# Altium project LimeSDR-Mini_2v1.PrjPcb (part 3 of 5)

## Sheet 08_FPGA.SchDoc: FPGA
size A3; Organization: Lime Microsystems; Address1: Surrey Tech Centre; Address2: Guildford GU2 7YG; Address3: Surrey; Address4: United Kingdom; Revision: v2.1; SheetNumber: 8; SheetTotal: 10
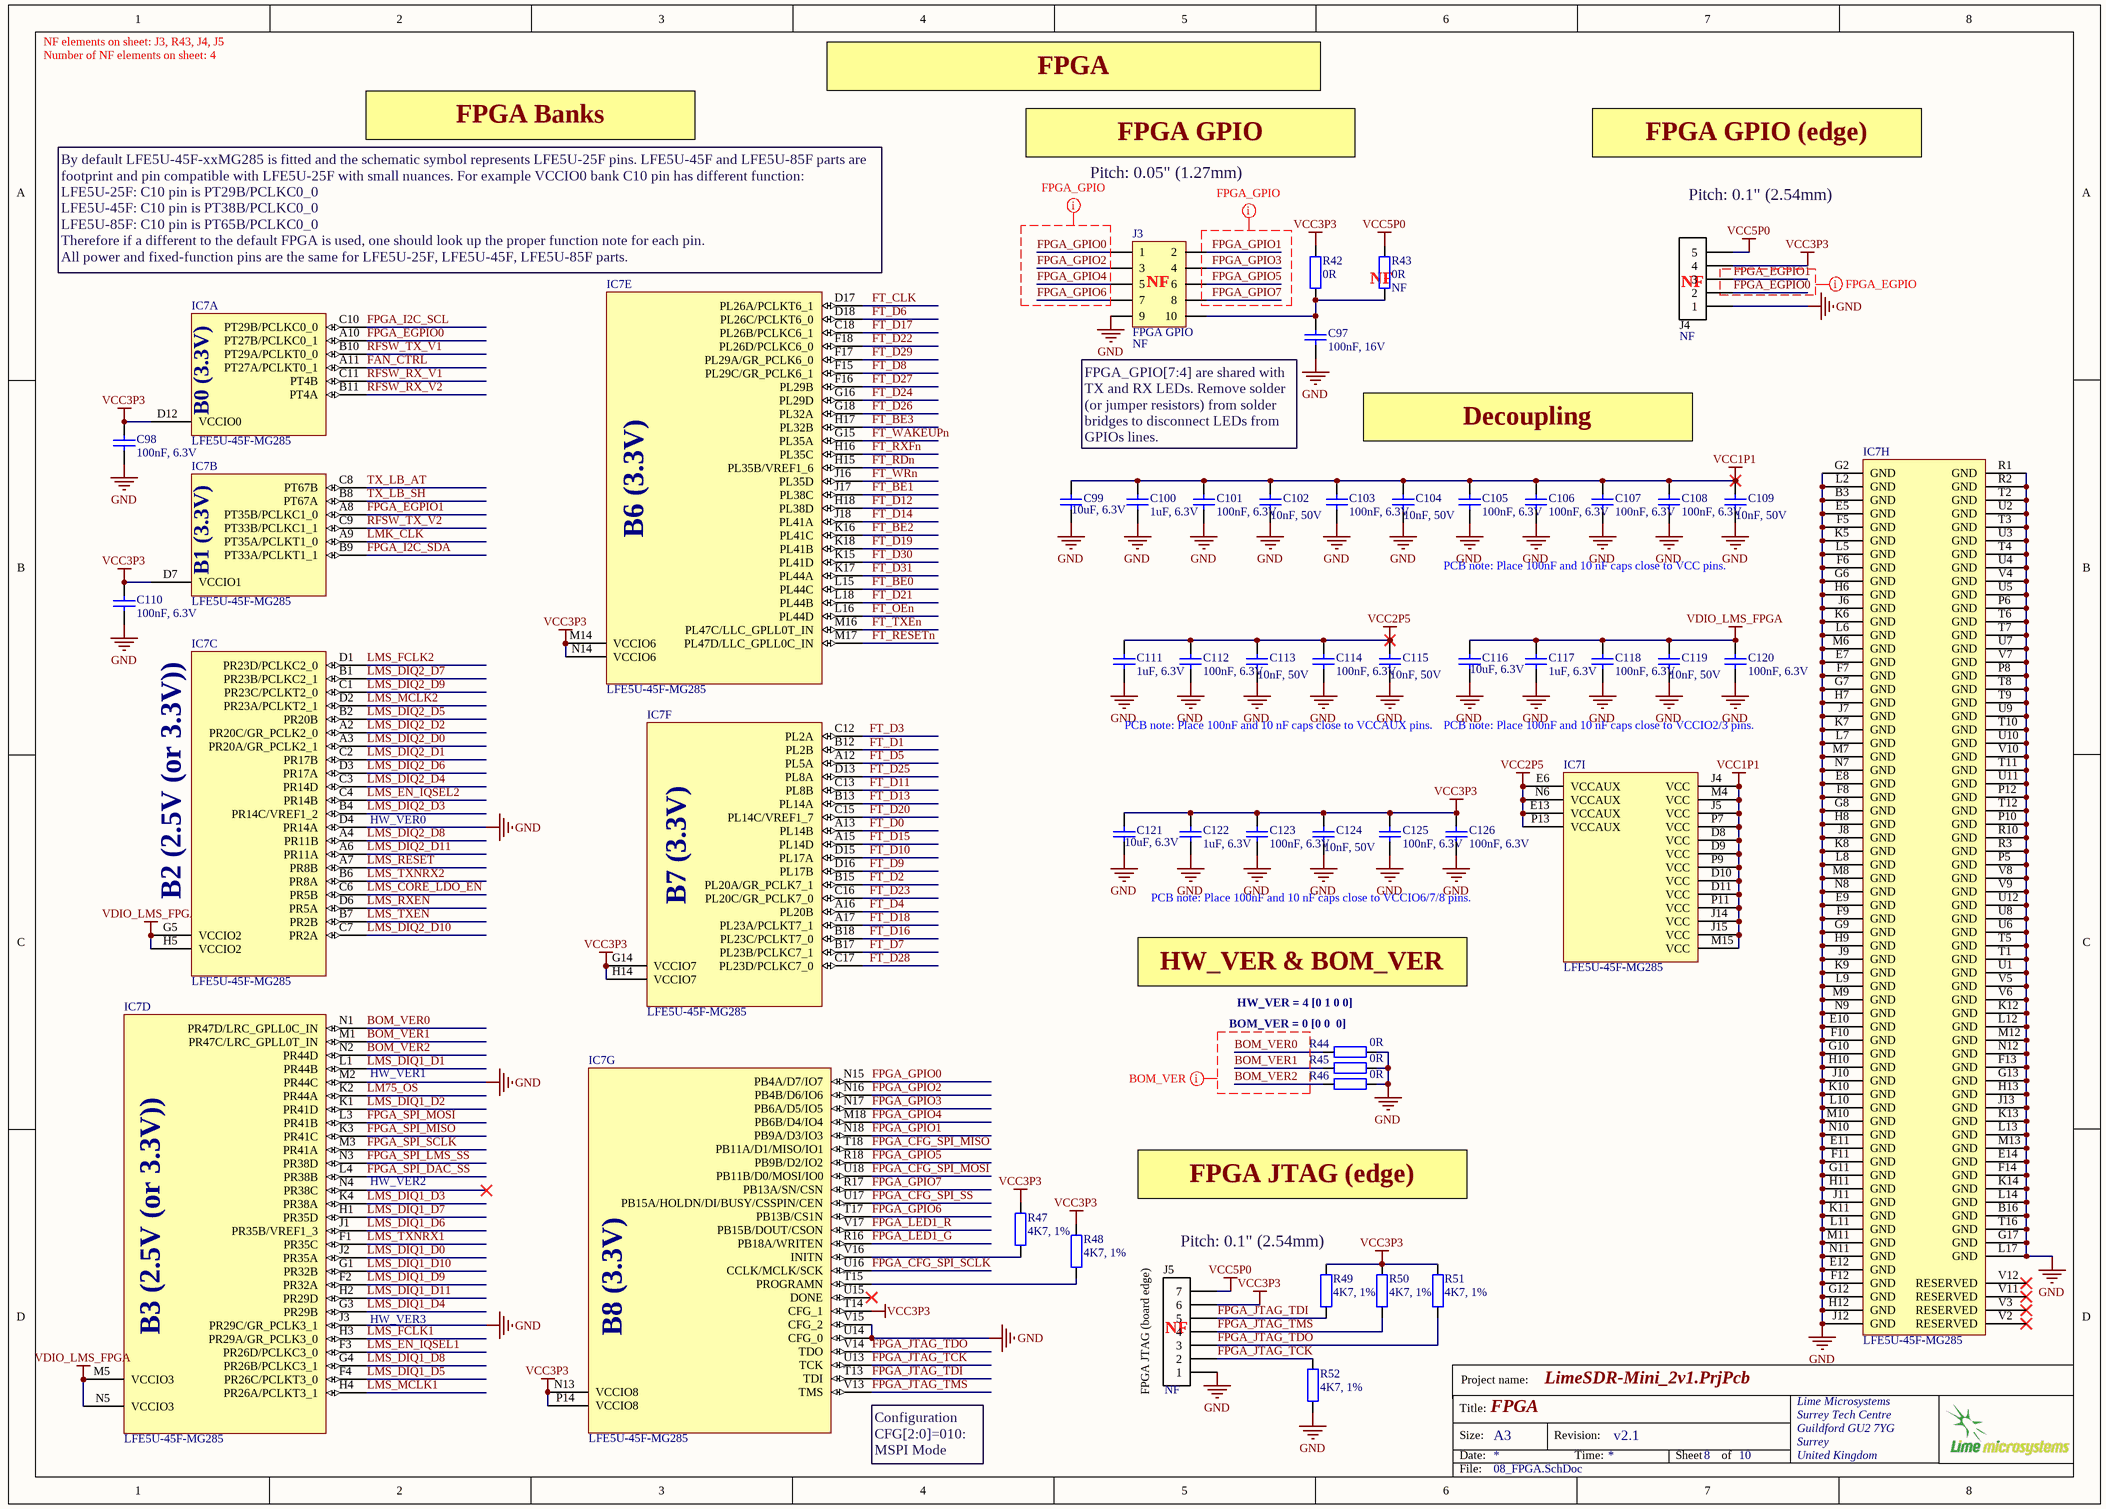
[diagram p7: 08_FPGA.SchDoc]

### Parts
C97  100nF, 16V  [CAP0402]
C98  100nF, 6.3V  [CAP0201]
C99  10uF, 6.3V  [CAP0603]
C100  1uF, 6.3V  [CAP0201]
C101  100nF, 6.3V  [CAP0201]
C102  10nF, 50V  [CAP0402]
C103  100nF, 6.3V  [CAP0201]
C104  10nF, 50V  [CAP0402]
C105  100nF, 6.3V  [CAP0201]
C106  100nF, 6.3V  [CAP0201]
C107  100nF, 6.3V  [CAP0201]
C108  100nF, 6.3V  [CAP0201]
C109  10nF, 50V  [CAP0402]
C110  100nF, 6.3V  [CAP0201]
C111  1uF, 6.3V  [CAP0201]
C112  100nF, 6.3V  [CAP0201]
C113  10nF, 50V  [CAP0402]
C114  100nF, 6.3V  [CAP0201]
C115  10nF, 50V  [CAP0402]
C116  10uF, 6.3V  [CAP0603]
C117  1uF, 6.3V  [CAP0201]
C118  100nF, 6.3V  [CAP0201]
C119  10nF, 50V  [CAP0402]
C120  100nF, 6.3V  [CAP0201]
C121  10uF, 6.3V  [CAP0603]
C122  1uF, 6.3V  [CAP0201]
C123  100nF, 6.3V  [CAP0201]
C124  10nF, 50V  [CAP0402]
C125  100nF, 6.3V  [CAP0201]
C126  100nF, 6.3V  [CAP0201]
IC7  LFE5U-45F-MG285  [LFE5U-25F-8MG285C_LATTICE_FPGA]  (parts A,B,C,D,E,F,G,H,I of 9)
J3  FPGA GPIO  Assembly Info: NF  [SWD_10_pin]
J4  Assembly Info: NF  [Header5x1_TH_v2]  (hidden comment: FPGA EGPIO (board edge))
J5  FPGA JTAG (board edge)  Assembly Info: NF  [Header7x1_TH_v2]
R42  0R  [RES0402]
R43  0R  Assembly Info: NF  [RES0402]
R44  0R  [RES0402]
R45  0R  [RES0402]
R46  0R  [RES0402]
R47  4K7, 1%  [RES0402]
R48  4K7, 1%  [RES0402]
R49  4K7, 1%  [RES0402]
R50  4K7, 1%  [RES0402]
R51  4K7, 1%  [RES0402]
R52  4K7, 1%  [RES0402]

### Nets
GND: C97.1 C98.2 C99.1 C100.1 C101.2 C102.1 C103.2 C104.1 C105.2 C106.2 C107.2 C108.2 C109.1 C110.2 C111.1 C112.2 C113.1 C114.2 C115.1 C116.1 C117.1 C118.2 C119.1 C120.2 C121.1 C122.2 C123.2 C124.1 C125.2 C126.2 IC7.B3(GND) IC7.B16(GND) IC7.D4(PR14A) IC7.E5(GND) IC7.E7(GND) IC7.E8(GND) IC7.E9(GND) IC7.E10(GND) IC7.E11(GND) IC7.E12(GND) IC7.E14(GND) IC7.F5(GND) IC7.F6(GND) IC7.F7(GND) IC7.F8(GND) IC7.F9(GND) IC7.F10(GND) IC7.F11(GND) IC7.F12(GND) IC7.F13(GND) IC7.F14(GND) IC7.G2(GND) IC7.G6(GND) IC7.G7(GND) IC7.G8(GND) IC7.G9(GND) IC7.G10(GND) IC7.G11(GND) IC7.G12(GND) IC7.G13(GND) IC7.G17(GND) IC7.H6(GND) IC7.H7(GND) IC7.H8(GND) IC7.H9(GND) IC7.H10(GND) IC7.H11(GND) IC7.H12(GND) IC7.H13(GND) IC7.J3(PR29C/GR_PCLK3_1) IC7.J6(GND) IC7.J7(GND) IC7.J8(GND) IC7.J9(GND) IC7.J10(GND) IC7.J11(GND) IC7.J12(GND) IC7.J13(GND) IC7.K5(GND) IC7.K6(GND) IC7.K7(GND) IC7.K8(GND) IC7.K9(GND) IC7.K10(GND) IC7.K11(GND) IC7.K12(GND) IC7.K13(GND) IC7.K14(GND) IC7.L2(GND) IC7.L5(GND) IC7.L6(GND) IC7.L7(GND) IC7.L8(GND) IC7.L9(GND) IC7.L10(GND) IC7.L11(GND) IC7.L12(GND) IC7.L13(GND) IC7.L14(GND) IC7.L17(GND) IC7.M2(PR44C) IC7.M6(GND) IC7.M7(GND) IC7.M8(GND) IC7.M9(GND) IC7.M10(GND) IC7.M11(GND) IC7.M12(GND) IC7.M13(GND) IC7.N7(GND) IC7.N8(GND) IC7.N9(GND) IC7.N10(GND) IC7.N11(GND) IC7.N12(GND) IC7.P5(GND) IC7.P6(GND) IC7.P8(GND) IC7.P10(GND) IC7.P12(GND) IC7.R1(GND) IC7.R2(GND) IC7.R3(GND) IC7.R10(GND) IC7.T1(GND) IC7.T2(GND) IC7.T3(GND) IC7.T4(GND) IC7.T5(GND) IC7.T6(GND) IC7.T7(GND) IC7.T8(GND) IC7.T9(GND) IC7.T10(GND) IC7.T11(GND) IC7.T12(GND) IC7.T16(GND) IC7.U1(GND) IC7.U2(GND) IC7.U3(GND) IC7.U4(GND) IC7.U5(GND) IC7.U6(GND) IC7.U7(GND) IC7.U8(GND) IC7.U9(GND) IC7.U10(GND) IC7.U11(GND) IC7.U12(GND) IC7.U14(CFG_0) IC7.V4(GND) IC7.V5(GND) IC7.V6(GND) IC7.V7(GND) IC7.V8(GND) IC7.V9(GND) IC7.V10(GND) IC7.V15(CFG_2) J3.9 J4.1 J5.1 R44.1 R45.1 R46.1 R52.2
VCC1P1: C99.2 C100.2 C101.1 C102.2 C103.1 C104.2 C105.1 C106.1 C107.1 C108.1 C109.2 IC7.D8(VCC) IC7.D9(VCC) IC7.D10(VCC) IC7.D11(VCC) IC7.J4(VCC) IC7.J5(VCC) IC7.J14(VCC) IC7.J15(VCC) IC7.M4(VCC) IC7.M15(VCC) IC7.P7(VCC) IC7.P9(VCC) IC7.P11(VCC)
VCC2P5: C111.2 C112.1 C113.2 C114.1 C115.2 IC7.E6(VCCAUX) IC7.E13(VCCAUX) IC7.N6(VCCAUX) IC7.P13(VCCAUX)
VCC3P3: C98.1 C110.1 C121.2 C122.1 C123.1 C124.2 C125.1 C126.1 IC7.D7(VCCIO1) IC7.D12(VCCIO0) IC7.G14(VCCIO7) IC7.H14(VCCIO7) IC7.M14(VCCIO6) IC7.N13(VCCIO8) IC7.N14(VCCIO6) IC7.P14(VCCIO8) IC7.T14(CFG_1) J4.4 J5.6 R42.1 R47.1 R48.1 R49.1 R50.1 R51.1
VCC5P0: J4.5 J5.7 R43.1
VDIO_LMS_FPGA: C116.2 C117.2 C118.1 C119.2 C120.1 IC7.G5(VCCIO2) IC7.H5(VCCIO2) IC7.M5(VCCIO3) IC7.N5(VCCIO3)
BOM_VER0: IC7.N1(PR47D/LRC_GPLL0C_IN) R44.2
BOM_VER1: IC7.M1(PR47C/LRC_GPLL0T_IN) R45.2
BOM_VER2: IC7.N2(PR44D) R46.2
FAN_CTRL: IC7.A11(PT27A/PCLKT0_1)
FPGA_CFG_SPI_MISO: IC7.T18(PB11A/D1/MISO/IO1)
FPGA_CFG_SPI_MOSI: IC7.U18(PB11B/D0/MOSI/IO0)
FPGA_CFG_SPI_SCLK: IC7.U16(CCLK/MCLK/SCK)
FPGA_CFG_SPI_SS: IC7.U17(PB15A/HOLDN/DI/BUSY/CSSPIN/CEN)
FPGA_EGPIO0: IC7.A10(PT27B/PCLKC0_1) J4.2
FPGA_EGPIO1: IC7.A8(PT35B/PCLKC1_0) J4.3
FPGA_GPIO0: IC7.N15(PB4A/D7/IO7) J3.1
FPGA_GPIO1: IC7.N18(PB9A/D3/IO3) J3.2
FPGA_GPIO2: IC7.N16(PB4B/D6/IO6) J3.3
FPGA_GPIO3: IC7.N17(PB6A/D5/IO5) J3.4
FPGA_GPIO4: IC7.M18(PB6B/D4/IO4) J3.5
FPGA_GPIO5: IC7.R18(PB9B/D2/IO2) J3.6
FPGA_GPIO6: IC7.T17(PB13B/CS1N) J3.7
FPGA_GPIO7: IC7.R17(PB13A/SN/CSN) J3.8
FPGA_I2C_SCL: IC7.C10(PT29B/PCLKC0_0)
FPGA_I2C_SDA: IC7.B9(PT33A/PCLKT1_1)
FPGA_JTAG_TCK: IC7.U13(TCK) J5.2 R52.1
FPGA_JTAG_TDI: IC7.T13(TDI) J5.5 R49.2
FPGA_JTAG_TDO: IC7.V14(TDO) J5.3 R51.2
FPGA_JTAG_TMS: IC7.V13(TMS) J5.4 R50.2
FPGA_LED1_G: IC7.R16(PB18A/WRITEN)
FPGA_LED1_R: IC7.V17(PB15B/DOUT/CSON)
FPGA_SPI_DAC_SS: IC7.L4(PR38B)
FPGA_SPI_LMS_SS: IC7.N3(PR38D)
FPGA_SPI_MISO: IC7.K3(PR41C)
FPGA_SPI_MOSI: IC7.L3(PR41B)
FPGA_SPI_SCLK: IC7.M3(PR41A)
FT_BE0: IC7.L15(PL44C)
FT_BE1: IC7.J17(PL38C)
FT_BE2: IC7.K16(PL41C)
FT_BE3: IC7.H17(PL32B)
FT_CLK: IC7.D17(PL26A/PCLKT6_1)
FT_D0: IC7.A13(PL14B)
FT_D1: IC7.B12(PL2B)
FT_D2: IC7.B15(PL20A/GR_PCLK7_1)
FT_D3: IC7.C12(PL2A)
FT_D4: IC7.A16(PL20B)
FT_D5: IC7.A12(PL5A)
FT_D6: IC7.D18(PL26C/PCLKT6_0)
FT_D7: IC7.B17(PL23B/PCLKC7_1)
FT_D8: IC7.F15(PL29C/GR_PCLK6_1)
FT_D9: IC7.D16(PL17B)
FT_D10: IC7.D15(PL17A)
FT_D11: IC7.C13(PL8B)
FT_D12: IC7.H18(PL38D)
FT_D13: IC7.B13(PL14A)
FT_D14: IC7.J18(PL41A)
FT_D15: IC7.A15(PL14D)
FT_D16: IC7.B18(PL23C/PCLKT7_0)
FT_D17: IC7.C18(PL26B/PCLKC6_1)
FT_D18: IC7.A17(PL23A/PCLKT7_1)
FT_D19: IC7.K18(PL41B)
FT_D20: IC7.C15(PL14C/VREF1_7)
FT_D21: IC7.L18(PL44B)
FT_D22: IC7.F18(PL26D/PCLKC6_0)
FT_D23: IC7.C16(PL20C/GR_PCLK7_0)
FT_D24: IC7.G16(PL29D)
FT_D25: IC7.D13(PL8A)
FT_D26: IC7.G18(PL32A)
FT_D27: IC7.F16(PL29B)
FT_D28: IC7.C17(PL23D/PCLKC7_0)
FT_D29: IC7.F17(PL29A/GR_PCLK6_0)
FT_D30: IC7.K15(PL41D)
FT_D31: IC7.K17(PL44A)
FT_OEn: IC7.L16(PL44D)
FT_RDn: IC7.H15(PL35B/VREF1_6)
FT_RESETn: IC7.M17(PL47D/LLC_GPLL0C_IN)
FT_RXFn: IC7.H16(PL35C)
FT_TXEn: IC7.M16(PL47C/LLC_GPLL0T_IN)
FT_WAKEUPn: IC7.G15(PL35A)
FT_WRn: IC7.J16(PL35D)
LM75_OS: IC7.K2(PR44A)
LMK_CLK: IC7.A9(PT35A/PCLKT1_0)
LMS_CORE_LDO_EN: IC7.C6(PR5B)
LMS_DIQ1_D0: IC7.J2(PR35A)
LMS_DIQ1_D1: IC7.L1(PR44B)
LMS_DIQ1_D2: IC7.K1(PR41D)
LMS_DIQ1_D3: IC7.K4(PR38A)
LMS_DIQ1_D4: IC7.G3(PR29B)
LMS_DIQ1_D5: IC7.F4(PR26C/PCLKT3_0)
LMS_DIQ1_D6: IC7.J1(PR35B/VREF1_3)
LMS_DIQ1_D7: IC7.H1(PR35D)
LMS_DIQ1_D8: IC7.G4(PR26B/PCLKC3_1)
LMS_DIQ1_D9: IC7.F2(PR32A)
LMS_DIQ1_D10: IC7.G1(PR32B)
LMS_DIQ1_D11: IC7.H2(PR29D)
LMS_DIQ2_D0: IC7.A3(PR20A/GR_PCLK2_1)
LMS_DIQ2_D1: IC7.C2(PR17B)
LMS_DIQ2_D2: IC7.A2(PR20C/GR_PCLK2_0)
LMS_DIQ2_D3: IC7.B4(PR14C/VREF1_2)
LMS_DIQ2_D4: IC7.C3(PR14D)
LMS_DIQ2_D5: IC7.B2(PR20B)
LMS_DIQ2_D6: IC7.D3(PR17A)
LMS_DIQ2_D7: IC7.B1(PR23B/PCLKC2_1)
LMS_DIQ2_D8: IC7.A4(PR11B)
LMS_DIQ2_D9: IC7.C1(PR23C/PCLKT2_0)
LMS_DIQ2_D10: IC7.C7(PR2A)
LMS_DIQ2_D11: IC7.A6(PR11A)
LMS_EN_IQSEL1: IC7.F3(PR26D/PCLKC3_0)
LMS_EN_IQSEL2: IC7.C4(PR14B)
LMS_FCLK1: IC7.H3(PR29A/GR_PCLK3_0)
LMS_FCLK2: IC7.D1(PR23D/PCLKC2_0)
LMS_MCLK1: IC7.H4(PR26A/PCLKT3_1)
LMS_MCLK2: IC7.D2(PR23A/PCLKT2_1)
LMS_RESET: IC7.A7(PR8B)
LMS_RXEN: IC7.D6(PR5A)
LMS_TXEN: IC7.B7(PR2B)
LMS_TXNRX1: IC7.F1(PR35C)
LMS_TXNRX2: IC7.B6(PR8A)
RFSW_RX_V1: IC7.C11(PT4B)
RFSW_RX_V2: IC7.B11(PT4A)
RFSW_TX_V1: IC7.B10(PT29A/PCLKT0_0)
RFSW_TX_V2: IC7.C9(PT33B/PCLKC1_1)
TX_LB_AT: IC7.C8(PT67B)
TX_LB_SH: IC7.B8(PT67A)
NetC97_2: C97.2 J3.10 R42.2 R43.2
NetIC7_T15: IC7.T15(PROGRAMN) R48.2
NetIC7_V16: IC7.V16(INITN) R47.2

Not connected (* = marked no-connect by the designer): IC7 N4(PR38C)* U15(DONE)* V2(RESERVED)* V3(RESERVED)* V11(RESERVED)* V12(RESERVED)*

### Layout directives
net class BOM_VER: BOM_VER0, BOM_VER1, BOM_VER2
net class FPGA_GPIO: FPGA_GPIO0, FPGA_GPIO1, FPGA_GPIO2, FPGA_GPIO3, FPGA_GPIO4, FPGA_GPIO5, FPGA_GPIO6, FPGA_GPIO7
net class FPGA_EGPIO: FPGA_EGPIO0, FPGA_EGPIO1

### Notes on the sheet
- NF elements on sheet: J3, R43, J4, J5
- Number of NF elements on sheet: 4
- FPGA
- FPGA Banks
- FPGA GPIO
- Pitch: 0.05" (1.27mm)
- FPGA GPIO (edge)
- (near J4) Pitch: 0.1" (2.54mm)
- (near IC7) By default LFE5U-45F-xxMG285 is fitted and the schematic symbol represents LFE5U-25F pins. LFE5U-45F and LFE5U-85F parts are footprint and pin compatible with LFE5U-25F with small nuances. For example VCCIO0 bank C10 pin has different function:
  LFE5U-25F: C10 pin is PT29B/PCLKC0_0
  LFE5U-45F: C10 pin is PT38B/PCLKC0_0
  LFE5U-85F: C10 pin is PT65B/PCLKC0_0
  Therefore if a different to the default FPGA is used, one should look up the proper function note for each pin.
  All power and fixed-function pins are the same for LFE5U-25F, LFE5U-45F, LFE5U-85F parts.
- (near J3) NF
- (near R43) NF
- (near J4) NF
- (near IC7) B0 (3.3V)
- (near C97) FPGA_GPIO[7:4] are shared with TX and RX LEDs. Remove solder (or jumper resistors) from solder bridges to disconnect LEDs from GPIOs lines.
- Decoupling
- (near IC7) B1 (3.3V)
- (near IC7) B6 (3.3V)
- PCB note: Place 100nF and 10 nF caps close to VCC pins.
- PCB note: Place 100nF and 10 nF caps close to VCCAUX pins.
- PCB note: Place 100nF and 10 nF caps close to VCCIO2/3 pins.
- (near IC7) HW_VER0
- (near IC7) B2 (2.5V (or 3.3V))
- (near IC7) B7 (3.3V)
- PCB note: Place 100nF and 10 nF caps close to VCCIO6/7/8 pins.
- HW_VER & BOM_VER
- (near R44) BOM_VER = 0 [0 0  0]
- HW_VER = 4 [0 1 0 0]
- (near IC7) HW_VER1
- (near IC7) HW_VER2
- FPGA JTAG (edge)
- (near R49) Pitch: 0.1" (2.54mm)
- (near IC7) HW_VER3
- (near J5) NF
- (near IC7) B3 (2.5V (or 3.3V))
- (near IC7) B8 (3.3V)
- (near IC7) Configuration
  CFG[2:0]=010:
  MSPI Mode
- Project name:
- Title:
- Size:
- Date:
- A3
- Revision:
- Time:
- Sheet
- of
- File:

### Library data of the parts
C97 = Cap_0402: Manufacturer: Murata Electronics; Manufacturer Part Number: GRM155R71C104KA88D; Part Description: 0.10µF ±10% 16V X7R Ceramic Capacitor -55°C ~ 125°C Surface Mount, MLCC 0402 (1005 Metric) 0.039" L x 0.020" W (1.00mm x 0.50mm); Tolerance: 10 %; Type: General Purpose MLCC; Capacitance: 0.1 uF; Case Length: 1 mm; Dielectric: X7R; Case Height: 0.5 mm; Temperature Coefficient / Code: +/- 15 %; Value: 100nF, 16V; Supplier 1: Mouser; Supplier Part Number 1: 81-GRM155R71C104KA88; Case Code - in: 0402; RoHS: RoHS Compliant; Operating Temperature Range: - 55 C to + 125 C; Series: GRM; Termination Style: SMD/SMT; Package / Case: 0402 (1005 metric); Voltage Rating DC: 16 V; Maximum Operating Temperature: + 125 C; Case Code - mm: 1005; Minimum Operating Temperature: - 55 C; Product Category: Low & Medium Capacitance SMD Ceramic Chip Capacitors; Packaging: Reel; Product: General Type MLCCs; Category: Multilayer Ceramic Capacitors MLCC - SMD/SMT; Brand: Murata Electronics; Case Width: 0.5 mm; RoHS - Mouser: Y; Standard Pack Qty: 10000; Minimum Order Quantity: 1; Reeling: True; Manufacturer Part Number 1: GRM155R71C104KA88D
C98 C101 C103 C105-C108 C110 C112 C114 C118 C120 C123 C125 C126 = Cap_0402: Manufacturer: Murata; Manufacturer Part Number 1: GRT033C81A104KE01D; Part Description: 0.10µF ±10% 6.3V X6S Ceramic Capacitor -55°C ~ 105°C Surface Mount, MLCC 0201 (0603 Metric) 0.024" L x 0.012" W (0.60mm x 0.30mm); Capacitance: 0.1 uF; Dielectric: X6S; Brand: Murata Electronics; Type: Voltage and Temperature Derating Recommended Product; Voltage Rating DC: 6.3 VDC; Product Status: New Product; Tolerance: 10 %; Value: 100nF, 6.3V; Package / Case: 0201 (0603 metric); Width: 0.3 mm; Minimum Order Quantity: 1; Category: Multilayer Ceramic Capacitors MLCC - SMD/SMT; Termination Style: SMD/SMT; Case Code - mm: 0603; Maximum Operating Temperature: + 125 C; Length: 0.6 mm; Product: General Type MLCCs; Case Code - in: 0201; RoHS: RoHS Compliant; Minimum Operating Temperature: - 55 C; RoHS - Mouser: Y; Height: 0.3 mm; Packaging: Reel; Series: GRM; Reeling: True; Supplier 1: Digi-Key; Supplier Part Number 1: 490-12232-1-ND
C99 C116 C121 = Cap_0603: Manufacturer Part Number 1: CC0603MRX5R5BB106; Manufacturer: Yageo; Part Description: 10µF ±20% 6.3V X5R Ceramic Capacitor -55°C ~ 85°C Surface Mount, MLCC 0603 (1608 Metric) 0.063" L x 0.031" W (1.60mm x 0.80mm); Capacitance: 10µF; Tolerance: ±20%; Supplier 1: Digi-Key; Supplier Part Number 1: 311-1448-2-ND; Package / Case: 0603 (1608 Metric); Category: Capacitors; Voltage - Rated: 6.3V; Value: 10uF, 6.3V
C100 C111 C117 = Cap_0402: Manufacturer: TDK Corporation; Manufacturer Part Number 1: JMK063ABJ105MP-F; Part Description: 1µF ±20% 6.3V X5R Ceramic Capacitor -55°C ~ 85°C Surface Mount, MLCC 0201 (0603 Metric) 0.024" L x 0.012" W (0.60mm x 0.30mm); Tolerance: ±20%; Capacitance: 1.0µF; Temperature Coefficient: X5R; Value: 1uF, 6.3V; Supplier 1: Digi-Key; Supplier Part Number 1: 587-5864-2-ND; Applications: General Purpose; Features: -; Lead Style: -; Ratings: -; Thickness (Max): -; Lead Spacing: -; Height - Seated (Max): -; Size / Dimension: 0.024" L x 0.012" W (0.60mm x 0.30mm); Mounting Type: Surface Mount, MLCC; Operating Temperature: -55°C ~ 85°C; Package / Case: 0201 (0603 Metric); Packaging: Cut Tape (CT); Voltage - Rated: 6.3V; Category: Capacitors; RoHS: RoHS Compliant
C102 C104 C109 C113 C115 C119 C124 = Cap_0402: Manufacturer: Murata; Manufacturer Part Number 1: GRM155R71H103KA88D; Part Description: 10000pF ±10% 50V Ceramic Capacitor X7R 0402 (1005 Metric); Dielectric: X7R; Material: Ceramic; Tolerance: 10%; Voltage: 25V; Supplier 1: Digi-Key; Supplier Part Number 1: 490-4516-1-ND; Capacitance: 10nF; value: 10nF, 50V; Packaging: Tape and Reel; Voltage Rating: 50V; Case/Package: 0402; Case Code (Imperial): 0402; Case Code (Metric): 1005; Depth: 0.5mm; Height: 0.5mm; Lead Free: Lead Free; Length: 1mm; Max Operating Temperature: 125°C; Min Operating Temperature: -55°C; Mount: Surface Mount; Number of Pins: 2; Package Quantity: 1; Pricing 1: 1=0,10000, 10=0,03800, 100=0,01690, 500=0,01208, 1000=0,00949, 2500=0,00862, 5000=0,00794 (USD); Radiation Hardening: No; REACH SVHC: No SVHC; RoHS: Yes; Stock 1: 8941817; Termination: SMD/SMT; Thickness: 0.022inch; Voltage Rating (DC): 50V; Width: 0.02inch
C122 = Cap_0402: Manufacturer: TDK Corporation; Manufacturer Part Number 1: JMK063ABJ105MP-F; Part Description: 1µF ±20% 6.3V X5R Ceramic Capacitor -55°C ~ 85°C Surface Mount, MLCC 0201 (0603 Metric) 0.024" L x 0.012" W (0.60mm x 0.30mm); Value: 1uF, 20%; Tolerance: ±20%; Capacitance: 1.0µF; Temperature Coefficient: X5R; Supplier 1: Digi-Key; Supplier Part Number 1: 587-5864-2-ND; Applications: General Purpose; Features: -; Lead Style: -; Ratings: -; Thickness (Max): -; Lead Spacing: -; Height - Seated (Max): -; Size / Dimension: 0.024" L x 0.012" W (0.60mm x 0.30mm); Mounting Type: Surface Mount, MLCC; Operating Temperature: -55°C ~ 85°C; Package / Case: 0201 (0603 Metric); Packaging: Cut Tape (CT); Voltage - Rated: 6.3V; Category: Capacitors; RoHS: RoHS Compliant
IC7 = LFE5U-25F-MG285: Part Description: series Field Programmable Gate Array (FPGA) IC 118 1990656 44000 285-LFBGA, CSPBGA; Manufacturer: Lattice Semiconductor; Manufacturer Part Number 1: LFE5U-45F-6MG285C; Number of Logic Blocks (LABs): 11000; Number of Logic Elements/Cells: 44000; RAM Size: 1990656b; Number of I/Os: 118; ComponentLink1URL: http://www.latticesemi.com/view_document?document_id=50461&src-supplier=Digi-Key; ComponentLink1Description: http://www.latticesemi.com/view_document?document_id=50461&src-supplier=Digi-Key; Supplier 1: Digi-Key; Supplier Part Number 1: LFE5U-45F-6MG285C-ND; Stock 1: 0; Pricing 1: 168=15,73000 (USD); RoHS: Yes; Mount: Surface Mount; Case/Package: TFBGA; Min Operating Temperature: 0°C; Max Operating Temperature: 85°C; RoHS Compliant: No
J3 = Header 5X2_SWD: Header, 5-Pin, Dual row; Manufacturer Part Number 1: M50-3600542; Manufacturer: Harwin Inc; Part Description: CONN HDR 1.27MM SMD AU 10POS; Number of Positions: 10; Molding Height Above Board: 0.039" (1.00mm); Row Spacing: 0.050" (1.27mm); Number of Positions Loaded: All; Connector Type: Unshrouded; Supplier 1: Digi-Key; Contact Mating Length: 0.118" (3.00mm); Category: Connectors, Interconnects; Color: Black; RoHS: RoHS Compliant; Number of Rows: 2; Contact Finish Thickness: 3µin (0.08µm); Height Stacking (Mating): -; Contact Finish: Gold; Termination: Solder; Mounting Type: Surface Mount; Pitch: 0.050" (1.27mm); Features: -; Packaging: Bulk; Supplier Part Number 1: 952-1389-ND
J4 = Header5P: Header, 5-pin; Manufacturer: Amphenol FCI; Manufacturer Part Number 1: 69190-405HLF; Part Description: 5 Positions Header Connector 0.100" (2.54mm) Through Hole Tin; Pitch - Mating: 0.100" (2.54mm); Style: Board to Board; Shrouding: Unshrouded; Number of Positions: 5; Number of Positions Loaded: All; Contact Length - Mating: 0.230" (5.84mm); Contact Length - Post: 0.120" (3.05mm); Overall Contact Length: 0.450" (11.43mm); Material Flammability Rating: UL94 V-0; Supplier 1: Digi-Key; Supplier Part Number 1: 609-4726-ND; RoHS: RoHS Compliant; Category: Connectors, Interconnects; Stock 1: 2326; Pricing 1: 1=0.28, 10=0.26, 100=0.1799, 500=0.15224, 1000=0.12456, 5000=0.11072, 10000=0.10034 (USD); Packaging: Bulk; Part Status: Active; Connector Type: Header; Contact Type: Male Pin; Number of Rows: 1; Row Spacing - Mating: -; Mounting Type: Through Hole; Termination: Press-Fit, Solder; Fastening Type: Push-Pull; Insulation Height: 0.100" (2.54mm); Contact Shape: Square; Contact Finish - Mating: Tin; Contact Finish Thickness - Mating: 100µin (2.54µm); Contact Finish - Post: Tin; Contact Material: Phosphor Bronze; Insulation Material: Polycyclohexylenedimethylene Terephthalate (PCT), Glass Filled; Features: -; Operating Temperature: -; Ingress Protection: -; Insulation Color: Black; Current Rating: -; Voltage Rating: -; Mated Stacking Heights: -; Contact Finish Thickness - Post: -; Applications: -; ComponentLink1URL: http://portal.fciconnect.com/Comergent//fci/drawing/69190.pdf; ComponentLink1Description: http://portal.fciconnect.com/Comergent//fci/drawing/69190.pdf
J5 = Header7P: Header, 7-pin; Manufacturer: Sullins Connector Solutions; Manufacturer Part Number 1: PEC07SAAN; Part Description: 7 Positions Header, Unshrouded, Breakaway Connector 0.100" (2.54mm) Through Hole Tin; Number of Positions Loaded: All; Pitch: 0.100" (2.54mm); Number of Positions: 7; Connector Type: Header, Unshrouded, Breakaway; Supplier 1: Digi-Key; Color: Black; Packaging: Bulk; Category: Connectors, Interconnects; Contact Finish: Tin; Number of Rows: 1; RoHS: RoHS Compliant; Contact Type: Male Pin; Mounting Type: Through Hole; Features: -; Contact Mating Length: 0.230" (5.84mm); Termination: Solder; Fastening Type: -; Contact Finish Thickness: 100µin (2.54µm); Row Spacing: -; Supplier Part Number 1: S1012E-07-ND
R42-R46 = Res_0402: Manufacturer: Yageo; Part Description: RES SMD 0.0OHM JUMPER 1/16W 0402; Manufacturer Part Number 1: RC0402JR-070RL; Power (Watts): 0.063W, 1/16W; Resistance (Ohms): 0.0; Tolerance: Jumper; Supplier 1: Digi-Key; Supplier Part Number 1: 311-0.0JRTR-ND; Composition: Thick Film; Package / Case: 0402 (1005 Metric); Category: Resistors; Value: 0R; Features: Moisture Resistant; Height: 0.016" (0.40mm); Number of Terminations: 2; Operating Temperature: -55°C ~ 155°C; Packaging: Tape & Reel (TR); RoHS: RoHS Compliant; Size / Dimension: 0.039" L x 0.020" W (1.00mm x 0.50mm); Supplier Device Package: 0402; Temperature Coefficient: -
R47-R52 = Res_0402: Manufacturer: Yageo; Manufacturer Part Number 1: RC0402FR-074K7L; Part Description: ±1% 0.063W, 1/16W Chip Resistor 0402 (1005 Metric) Moisture Resistant Thick Film; Power (Watts): 0.063W, 1/16W; Temperature Coefficient: ±100ppm/°C; Supplier 1: Digi-Key; Supplier Part Number 1: 311-4.7KLRCT-ND; RoHS: RoHS Compliant; Category: Resistors; Stock 1: 4788231; Pricing 1: 1=0.1, 10=0.014, 100=0.0056, 1000=0.00253, 2500=0.0022, 5000=0.00181 (USD); Packaging: Cut Tape (CT); Part Status: Active; Tolerance: ±1%; Composition: Thick Film; Features: Moisture Resistant; Operating Temperature: -55°C ~ 155°C; Package / Case: 0402 (1005 Metric); Supplier Device Package: 0402; Size / Dimension: 0.039" L x 0.020" W (1.00mm x 0.50mm); Height - Seated (Max): 0.016" (0.40mm); Failure Rate: -; ComponentLink1URL: http://www.yageo.com/documents/recent/PYu-RC_Group_51_RoHS_L_7.pdf; ComponentLink1Description: http://www.yageo.com/documents/recent/PYu-RC_Group_51_RoHS_L_7.pdf; Value: 4K7, 1%

## Sheet 09_USB3_0_FIFO.SchDoc: USB3.0 device
size A3; Organization: Lime Microsystems; Address1: Surrey Tech Centre; Address2: Guildford GU2 7YG; Address3: Surray; Address4: United Kingdom; Revision: v2.1; SheetNumber: 9; SheetTotal: 10
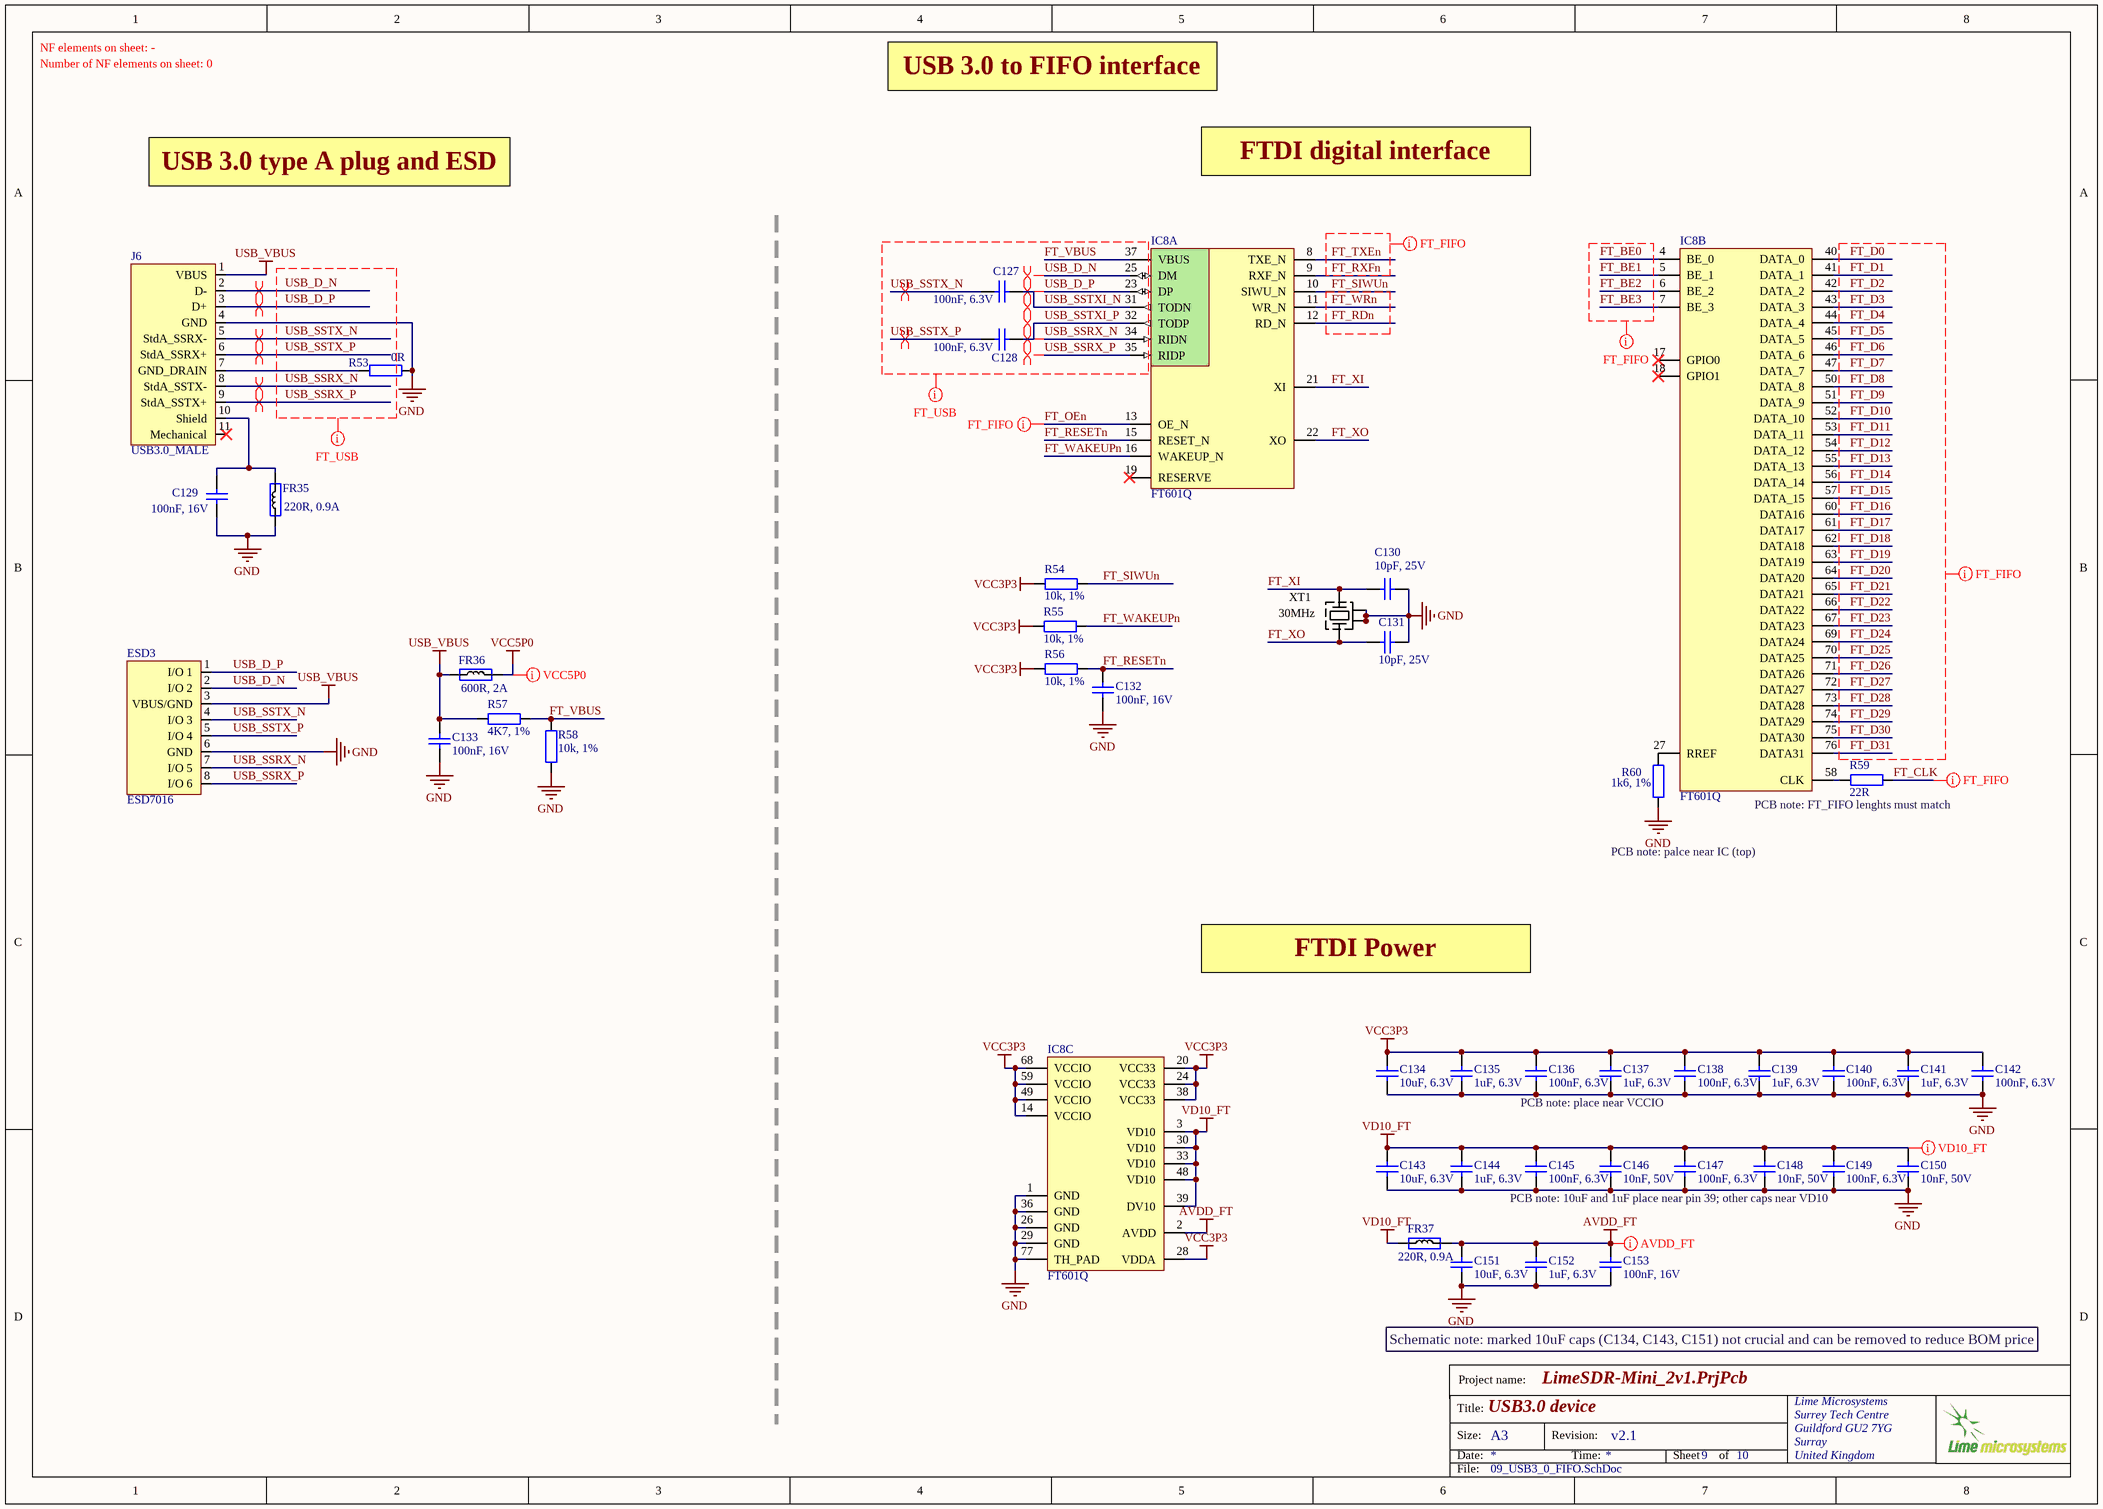
[diagram p8: 09_USB3_0_FIFO.SchDoc]

### Parts
C127  100nF, 6.3V  [CAP0201]
C128  100nF, 6.3V  [CAP0201]
C129  100nF, 16V  [CAP0402]
C130  10pF, 25V  [CAP0402]
C131  10pF, 25V  [CAP0402]
C132  100nF, 16V  [CAP0402]
C133  100nF, 16V  [CAP0402]
C134  10uF, 6.3V  [CAP0603]
C135  1uF, 6.3V  [CAP0201]
C136  100nF, 6.3V  [CAP0201]
C137  1uF, 6.3V  [CAP0201]
C138  100nF, 6.3V  [CAP0201]
C139  1uF, 6.3V  [CAP0201]
C140  100nF, 6.3V  [CAP0201]
C141  1uF, 6.3V  [CAP0201]
C142  100nF, 6.3V  [CAP0201]
C143  10uF, 6.3V  [CAP0603]
C144  1uF, 6.3V  [CAP0201]
C145  100nF, 6.3V  [CAP0201]
C146  10nF, 50V  [CAP0402]
C147  100nF, 6.3V  [CAP0201]
C148  10nF, 50V  [CAP0402]
C149  100nF, 6.3V  [CAP0201]
C150  10nF, 50V  [CAP0402]
C151  10uF, 6.3V  [CAP0603]
C152  1uF, 6.3V  [CAP0201]
C153  100nF, 16V  [CAP0402]
ESD3  ESD7016  [ESD7016]
FR35  220R, 0.9A  [RES0402]
FR36  600R, 2A  [RES0805]
FR37  220R, 0.9A  [RES0402]
IC8  FT601Q  [FT601Q]  (parts A,B,C of 3)
J6  USB3.0_MALE  [USB3A_SM]
R53  0R  [RES0402]
R54  10k, 1%  [RES0402]
R55  10k, 1%  [RES0402]
R56  10k, 1%  [RES0402]
R57  4K7, 1%  [RES0402]
R58  10k, 1%  [RES0402]
R59  22R  [RES0402]
R60  1k6, 1%  [RES0402]
XT1  30MHz  [CRYSTAL_4-LCC]

### Nets
AVDD_FT: C151.2 C152.2 C153.1 FR37.2 IC8.2(AVDD)
GND: C129.2 C130.2 C131.2 C132.2 C133.2 C134.1 C135.1 C136.2 C137.1 C138.2 C139.1 C140.2 C141.1 C142.2 C143.1 C144.1 C145.2 C146.2 C147.2 C148.2 C149.2 C150.2 C151.1 C152.1 C153.2 ESD3.6(GND) FR35.1 IC8.1(GND) IC8.26(GND) IC8.29(GND) IC8.36(GND) IC8.77(TH_PAD) J6.4(GND) R53.1 R58.1 R60.1 XT1.2(GND) XT1.4(GND)
USB_VBUS: C133.1 ESD3.3(VBUS/GND) FR36.1 J6.1(VBUS) R57.2
VCC3P3: C134.2 C135.2 C136.1 C137.2 C138.1 C139.2 C140.1 C141.2 C142.1 IC8.14(VCCIO) IC8.20(VCC33) IC8.24(VCC33) IC8.28(VDDA) IC8.38(VCC33) IC8.49(VCCIO) IC8.59(VCCIO) IC8.68(VCCIO) R54.2 R55.2 R56.2
VCC5P0: FR36.2
VD10_FT: C143.2 C144.2 C145.1 C146.1 C147.1 C148.1 C149.1 C150.1 FR37.1 IC8.3(VD10) IC8.30(VD10) IC8.33(VD10) IC8.39(DV10) IC8.48(VD10)
FT_BE0: IC8.4(BE_0)
FT_BE1: IC8.5(BE_1)
FT_BE2: IC8.6(BE_2)
FT_BE3: IC8.7(BE_3)
FT_CLK: R59.1
FT_D0: IC8.40(DATA_0)
FT_D1: IC8.41(DATA_1)
FT_D2: IC8.42(DATA_2)
FT_D3: IC8.43(DATA_3)
FT_D4: IC8.44(DATA_4)
FT_D5: IC8.45(DATA_5)
FT_D6: IC8.46(DATA_6)
FT_D7: IC8.47(DATA_7)
FT_D8: IC8.50(DATA_8)
FT_D9: IC8.51(DATA_9)
FT_D10: IC8.52(DATA_10)
FT_D11: IC8.53(DATA_11)
FT_D12: IC8.54(DATA_12)
FT_D13: IC8.55(DATA_13)
FT_D14: IC8.56(DATA_14)
FT_D15: IC8.57(DATA_15)
FT_D16: IC8.60(DATA16)
FT_D17: IC8.61(DATA17)
FT_D18: IC8.62(DATA18)
FT_D19: IC8.63(DATA19)
FT_D20: IC8.64(DATA20)
FT_D21: IC8.65(DATA21)
FT_D22: IC8.66(DATA22)
FT_D23: IC8.67(DATA23)
FT_D24: IC8.69(DATA24)
FT_D25: IC8.70(DATA25)
FT_D26: IC8.71(DATA26)
FT_D27: IC8.72(DATA27)
FT_D28: IC8.73(DATA28)
FT_D29: IC8.74(DATA29)
FT_D30: IC8.75(DATA30)
FT_D31: IC8.76(DATA31)
FT_OEn: IC8.13(OE_N)
FT_RDn: IC8.12(RD_N)
FT_RESETn: C132.1 IC8.15(RESET_N) R56.1
FT_RXFn: IC8.9(RXF_N)
FT_SIWUn: IC8.10(SIWU_N) R54.1
FT_TXEn: IC8.8(TXE_N)
FT_VBUS: IC8.37(VBUS) R57.1 R58.2
FT_WAKEUPn: IC8.16(WAKEUP_N) R55.1
FT_WRn: IC8.11(WR_N)
FT_XI: C130.1 IC8.21(XI) XT1.3(X)
FT_XO: C131.1 IC8.22(XO) XT1.1(X)
USB_D_N: ESD3.2(I/O_2) IC8.25(DM) J6.2(D-)
USB_D_P: ESD3.1(I/O_1) IC8.23(DP) J6.3(D+)
USB_SSRX_N: ESD3.7(I/O_5) IC8.34(RIDN) J6.8(StdA_SSTX-)
USB_SSRX_P: ESD3.8(I/O_6) IC8.35(RIDP) J6.9(StdA_SSTX+)
USB_SSTX_N: C127.1 ESD3.4(I/O_3) J6.5(StdA_SSRX-)
USB_SSTX_P: C128.1 ESD3.5(I/O_4) J6.6(StdA_SSRX+)
USB_SSTXI_N: C127.2 IC8.31(TODN)
USB_SSTXI_P: C128.2 IC8.32(TODP)
NetC129_1: C129.1 FR35.2 J6.10(Shield)
NetIC8_27: IC8.27(RREF) R60.2
NetIC8_58: IC8.58(CLK) R59.2
NetJ6_7: J6.7(GND_DRAIN) R53.2

Not connected (* = marked no-connect by the designer): IC8 17(GPIO0)* 18(GPIO1)* 19(RESERVE)*; J6 11(Mechanical)*

### Layout directives
net class FT_FIFO: FT_BE0, FT_BE1, FT_BE2, FT_BE3, FT_CLK, FT_D0, FT_D1, FT_D2, FT_D3, FT_D4, FT_D5, FT_D6, FT_D7, FT_D8, FT_D9, FT_D10, FT_D11, FT_D12, FT_D13, FT_D14, FT_D15, FT_D16, FT_D17, FT_D18, FT_D19, FT_D20, FT_D21, FT_D22, FT_D23, FT_D24, FT_D25, FT_D26, FT_D27, FT_D28, FT_D29, FT_D30, FT_D31, FT_OEn, FT_RXFn, FT_TXEn
net class VCC5P0: VCC5P0
differential pair: USB_D_N, USB_D_P, USB_SSRX_N, USB_SSRX_P, USB_SSTX_N, USB_SSTX_P, USB_SSTXI_N, USB_SSTXI_P
net class FT_USB: FT_VBUS, USB_D_N, USB_D_P, USB_SSRX_N, USB_SSRX_P, USB_SSTX_N, USB_SSTX_P, USB_SSTXI_N, USB_SSTXI_P
net class VD10_FT: VD10_FT
net class AVDD_FT: AVDD_FT

### Notes on the sheet
- NF elements on sheet: -
- Number of NF elements on sheet: 0
- USB 3.0 to FIFO interface
- USB 3.0 type A plug and ESD
- FTDI digital interface
- PCB note: palce near IC (top)
- PCB note: FT_FIFO lenghts must match
- FTDI Power
- PCB note: place near VCCIO
- PCB note: 10uF and 1uF place near pin 39; other caps near VD10
- Schematic note: marked 10uF caps (C134, C143, C151) not crucial and can be removed to reduce BOM price
- Project name:
- Title:
- Size:
- Date:
- A3
- Revision:
- Time:
- Sheet
- of
- File:

### Library data of the parts
C127 C128 C136 C138 C140 C142 C145 C147 C149 = Cap_0402: as C98 on sheet 08_FPGA; Value: 100nF, 6.3V; Package / Case: 0201 (0603 metric); Width: 0.3 mm; Minimum Order Quantity: 1; Category: Multilayer Ceramic Capacitors MLCC - SMD/SMT; Termination Style: SMD/SMT; Case Code - mm: 0603; Maximum Operating Temperature: + 125 C; Length: 0.6 mm; Product: General Type MLCCs; Case Code - in: 0201; RoHS: RoHS Compliant; Minimum Operating Temperature: - 55 C; RoHS - Mouser: Y; Height: 0.3 mm; Packaging: Reel; Series: GRM; Reeling: True; Supplier 1: Digi-Key; Supplier Part Number 1: 490-12232-1-ND
C129 C132 C133 = Cap_0603: Manufacturer Part Number 1: GRM155R71C104KA88D; Part Description: 0.10µF ±10% 16V X7R Ceramic Capacitor -55°C ~ 125°C Surface Mount, MLCC 0402 (1005 Metric) 0.039" L x 0.020" W (1.00mm x 0.50mm); Brand: Murata Electronics; Tolerance: 10 %; Type: General Purpose MLCC; Capacitance: 0.1 uF; Temperature Coefficient / Code: +/- 15 %; Case Height: 0.5 mm; Case Length: 1 mm; Dielectric: X7R; Supplier 1: Mouser; Supplier Part Number 1: 81-GRM155R71C104KA88; Case Code - in: 0402; Manufacturer: Murata Electronics; Category: Multilayer Ceramic Capacitors MLCC - SMD/SMT; Voltage Rating DC: 16 V; Value: 100nF, 16V; Manufacturer Part Number: GRM155R71C104KA88D; Case Code - mm: 1005; Case Width: 0.5 mm; Maximum Operating Temperature: + 125 C; Minimum Operating Temperature: - 55 C; Minimum Order Quantity: 1; Operating Temperature Range: - 55 C to + 125 C; Package / Case: 0402 (1005 metric); Packaging: Reel; Product: General Type MLCCs; Product Category: Low & Medium Capacitance SMD Ceramic Chip Capacitors; Reeling: True; RoHS - Mouser: Y; RoHS: RoHS Compliant; Series: GRM; Standard Pack Qty: 10000; Termination Style: SMD/SMT
C130 C131 = Cap_0402: Manufacturer: AVX; Manufacturer Part Number 1: 04023A100JAT2A; Part Description: 10pF ±5% 25V C0G, NP0 Ceramic Capacitor -55°C ~ 125°C Surface Mount, MLCC 0402 (1005 Metric) 0.039" L x 0.020" W (1.00mm x 0.50mm); Capacitance: 10; Ceramic Capacitor Case: 0402 [1005 Metric]; Capacitance Tolerance: ± 5%; Capacitor Case Style: 0402 [1005 Metric]<!--FANDB--><div class="features-and-benefits-container"></div>; Voltage Rating: 25; Supplier 1: Farnell; Supplier Part Number 1: 2332478RL; value: 10pF, 25V; Capacitance Tolerance ±: ± 5%; MSL: MSL 1 - Unlimited; Operating Temperature Max: 125; Operating Temperature Min: -55; Packaging: Cut Tape
C134 C143 C151 = Cap_0603: as C99 on sheet 08_FPGA; Supplier 1: Digi-Key; Supplier Part Number 1: 311-1448-2-ND; Package / Case: 0603 (1608 Metric); Category: Capacitors; Voltage - Rated: 6.3V; Value: 10uF, 6.3V
C135 C137 C139 C141 C144 C152 = Cap_0402: as C100 on sheet 08_FPGA; Value: 1uF, 6.3V; Supplier 1: Digi-Key; Supplier Part Number 1: 587-5864-2-ND; Applications: General Purpose; Features: -; Lead Style: -; Ratings: -; Thickness (Max): -; Lead Spacing: -; Height - Seated (Max): -; Size / Dimension: 0.024" L x 0.012" W (0.60mm x 0.30mm); Mounting Type: Surface Mount, MLCC; Operating Temperature: -55°C ~ 85°C; Package / Case: 0201 (0603 Metric); Packaging: Cut Tape (CT); Voltage - Rated: 6.3V; Category: Capacitors; RoHS: RoHS Compliant
C146 C148 C150 = Cap_0402: Part Description: 10000pF ±10% 50V Ceramic Capacitor X7R 0402 (1005 Metric); Manufacturer: Murata; Manufacturer Part Number 1: GRM155R71H103KA88D; Tolerance: 10%; Dielectric: X7R; Material: Ceramic; Voltage: 25V; Value: 10nF, 50V; Supplier 1: Digi-Key; Supplier Part Number 1: 490-4516-1-ND; RoHS: Yes; Stock 1: 8941817; Pricing 1: 1=0,10000, 10=0,03800, 100=0,01690, 500=0,01208, 1000=0,00949, 2500=0,00862, 5000=0,00794 (USD); Packaging: Tape and Reel; Capacitance: 10nF; Case/Package: 0402; Case Code (Imperial): 0402; Case Code (Metric): 1005; Depth: 0.5mm; Height: 0.5mm; Lead Free: Lead Free; Length: 1mm; Max Operating Temperature: 125°C; Min Operating Temperature: -55°C; Mount: Surface Mount; Number of Pins: 2; Package Quantity: 1; Radiation Hardening: No; REACH SVHC: No SVHC; Termination: SMD/SMT; Thickness: 0.022inch; Voltage Rating (DC): 50V; Voltage Rating: 50V; Width: 0.02inch
C153 = Cap_0402: as C97 on sheet 08_FPGA; Value: 100nF, 16V; Supplier 1: Mouser; Supplier Part Number 1: 81-GRM155R71C104KA88; Case Code - in: 0402; RoHS: RoHS Compliant; Operating Temperature Range: - 55 C to + 125 C; Series: GRM; Termination Style: SMD/SMT; Package / Case: 0402 (1005 metric); Voltage Rating DC: 16 V; Maximum Operating Temperature: + 125 C; Case Code - mm: 1005; Minimum Operating Temperature: - 55 C; Product Category: Low & Medium Capacitance SMD Ceramic Chip Capacitors; Packaging: Reel; Product: General Type MLCCs; Category: Multilayer Ceramic Capacitors MLCC - SMD/SMT; Brand: Murata Electronics; Case Width: 0.5 mm; RoHS - Mouser: Y; Standard Pack Qty: 10000; Minimum Order Quantity: 1; Reeling: True; Manufacturer Part Number 1: GRM155R71C104KA88D
ESD3 = ESD7016: Manufacturer Part Number 1: ESD7016MUTAG; Manufacturer: ON Semiconductor; Part Description: TVS DIODE 5VWM 10VC 8UDFN; Unidirectional Channels: 8; Capacitance @ Frequency: 0.15pF @ 1MHz; Power Line Protection: No; Voltage - Reverse Standoff (Typ): 5V (Max); Voltage - Breakdown (Min): 5.5V; Current - Peak Pulse (10/1000µs): 1A (8/20µs); Voltage - Clamping (Max) @ Ipp: 10V; Supplier 1: Digi-Key; Category: Circuit Protection; RoHS: RoHS Compliant; Bidirectional Channels: -; Packaging: Digi-Reel®; Type: Zener; Operating Temperature: -55°C ~ 125°C (TJ); Mounting Type: Surface Mount; Power - Peak Pulse: -; Package / Case: 8-UFSFN; Supplier Device Package: 8-UDFN (3.3x1.0); Applications: General Purpose; Supplier Part Number 1: ESD7016MUTAGOSDKR-ND
FR35 FR37 = Ferrite: Manufacturer: TDK Corporation; Manufacturer Part Number 1: MPZ1005S221ET000; Part Description: FERRITE BEAD 220 OHM 0402 1LN; Impedance @ Frequency: 220 Ohm @ 100MHz; Current Rating: 900mA; DC Resistance (DCR): 220 mOhm Max; Supplier 1: Digi-Key; Package / Case: 0402 (1005 Metric); Category: Filters; Supplier Part Number 1: 445-9329-2-ND; Value: 220R, 0.9A
FR36 = Ferrite: Manufacturer Part Number 1: MPZ2012S601AT000; Manufacturer: TDK Corporation; Part Description: FERRITE BEAD 600 OHM 0805 1LN; Filter Type: Differential Mode - Single; Impedance @ Frequency: 600 Ohm @ 100MHz; DC Resistance (DCR): 100 mOhm Max; Supplier 1: Digi-Key; Supplier Part Number 1: 445-2206-2-ND; Mounting Type: Surface Mount; RoHS: RoHS Compliant; Height (Max): 0.041" (1.05mm); Packaging: Tape & Reel (TR); Category: Filters; Current Rating: 2A; Package / Case: 0805 (2012 Metric); Size / Dimension: 0.079" L x 0.049" W (2.00mm x 1.25mm)
IC8 = FT601Q: Manufacturer: FTDI, Future Technology Devices International Ltd; Manufacturer Part Number 1: FT601Q-B-T; Part Description: IC USB3-32BIT SYNC FIFO 76QFN; Function: Bridge, USB to FIFO; Standards: USB 3.0; Voltage - Supply: 1.65 V ~ 3.6 V; Protocol: USB; Interface: FIFO; Supplier 1: Digi-Key; Operating Temperature: -40°C ~ 85°C; Packaging: Tray; Category: Integrated Circuits (ICs); Package / Case: 76-VFQFN Exposed Pad; Supplier Device Package: 76-QFN (9x9); Current - Supply: -; RoHS: RoHS Compliant; Supplier Part Number 1: 768-1311-ND
J6 = USB3.0_MALE: Manufacturer: Wurth Electronics Inc.; Manufacturer Part Number 1: 692112030100; Part Description: USB - A USB 3.0 (USB 3.1 Gen 1, Superspeed) Plug Connector 9 Position Surface Mount, Right Angle; Connector Type: USB - A; Number of Contacts: 9; Gender: Plug; Specifications: USB 3.0 (USB 3.1 Gen 1, Superspeed); Number of Ports: 1; Current Rating: 0.25A, 1.8A; Voltage - Rated: 30VAC; Mating Cycles: 5000; Shielding: Shielded; Material Flammability Rating: UL94 V-0; Supplier 1: Digi-Key; Supplier Part Number 1: 732-3157-ND; RoHS: RoHS Compliant; Category: Connectors, Interconnects; Stock 1: 2119; Pricing 1: 1=3, 10=2.65, 50=2.497, 100=2.242, 500=2.03802 (USD); Packaging: Tray; Part Status: Active; Mounting Type: Surface Mount, Right Angle; Mounting Feature: Horizontal; Termination: Solder; Features: Board Guide, Board Lock; Ingress Protection: -; Operating Temperature: -20°C ~ 85°C; Contact Finish: Gold; Shell/Shielding Material: Steel; Insulation Color: Blue; ComponentLink1URL: http://katalog.we-online.de/em/datasheet/692112030100.pdf; ComponentLink1Description: http://katalog.we-online.de/em/datasheet/692112030100.pdf
R53 = Res_0402: Manufacturer Part Number 1: RC0402JR-070RL; Manufacturer: Yageo; Part Description: RES SMD 0.0OHM JUMPER 1/16W 0402; Resistance (Ohms): 0.0; Tolerance: Jumper; Power (Watts): 0.063W, 1/16W; Value: 0R; Supplier 1: Digi-Key; Supplier Part Number 1: 311-0.0JRTR-ND; Category: Resistors; Temperature Coefficient: -; Features: Moisture Resistant; Supplier Device Package: 0402; Height: 0.016" (0.40mm); Package / Case: 0402 (1005 Metric); Operating Temperature: -55°C ~ 155°C; Size / Dimension: 0.039" L x 0.020" W (1.00mm x 0.50mm); Composition: Thick Film; Packaging: Tape & Reel (TR); Number of Terminations: 2; RoHS: RoHS Compliant
R54-R56 R58 = Res_0402: Manufacturer: Yageo; Manufacturer Part Number 1: RC0402FR-0710KL; Part Description: RES SMD 10K OHM 1% 1/16W 0402; Temperature Coefficient: ±100ppm/°C; Power (Watts): 0.063W, 1/16W; Value: 10k, 1%; Supplier 1: Digi-Key; Supplier Part Number 1: 311-10.0KLRTR-ND; Resistance (Ohms): 10k; Packaging: Tape & Reel (TR); RoHS: RoHS Compliant; Package / Case: 0402 (1005 Metric); Tolerance: ±1%; Operating Temperature: -55°C ~ 155°C; Size / Dimension: 0.039" L x 0.020" W (1.00mm x 0.50mm); Number of Terminations: 2; Category: Resistors; Height: 0.016" (0.40mm); Supplier Device Package: 0402; Features: Moisture Resistant; Composition: Thick Film
R57 = Res_0402: as R47 on sheet 08_FPGA; Supplier 1: Digi-Key; Supplier Part Number 1: 311-4.7KLRCT-ND; RoHS: RoHS Compliant; Category: Resistors; Stock 1: 4788231; Pricing 1: 1=0.1, 10=0.014, 100=0.0056, 1000=0.00253, 2500=0.0022, 5000=0.00181 (USD); Packaging: Cut Tape (CT); Part Status: Active; Tolerance: ±1%; Composition: Thick Film; Features: Moisture Resistant; Operating Temperature: -55°C ~ 155°C; Package / Case: 0402 (1005 Metric); Supplier Device Package: 0402; Size / Dimension: 0.039" L x 0.020" W (1.00mm x 0.50mm); Height - Seated (Max): 0.016" (0.40mm); Failure Rate: -; ComponentLink1URL: http://www.yageo.com/documents/recent/PYu-RC_Group_51_RoHS_L_7.pdf; ComponentLink1Description: http://www.yageo.com/documents/recent/PYu-RC_Group_51_RoHS_L_7.pdf; Value: 4K7, 1%
R59 = Res_0402: Part Description: RES SMD 22 OHM 1% 1/16W 0402; Manufacturer Part Number 1: RC0402FR-0722RL; Manufacturer: Yageo; Tolerance: ±1%; Temperature Coefficient: ±100ppm/°C; Resistance (Ohms): 22; Supplier 1: Digi-Key; Supplier Part Number 1: 311-22.0LRTR-ND; Supplier Device Package: 0402; Composition: Thick Film; Category: Resistors; Value: 22R
R60 = Res_0402: Manufacturer Part Number 1: RC0402FR-071K6L; Manufacturer: Yageo; Part Description: RES SMD 1.6K OHM 1% 1/16W 0402; Resistance (Ohms): 1.6k; Temperature Coefficient: ±100ppm/°C; Power (Watts): 0.063W, 1/16W; Value: 1k6, 1%; Number of Terminations: 2; Height: 0.016" (0.40mm); Supplier Device Package: 0402; Size / Dimension: 0.039" L x 0.020" W (1.00mm x 0.50mm); Supplier Part Number 1: YAG3045CT-ND; Features: Moisture Resistant; Operating Temperature: -55°C ~ 155°C; Supplier 1: Digi-Key; Category: Resistors; RoHS: RoHS Compliant; Packaging: Cut Tape (CT); Composition: Thick Film; Tolerance: ±1%; Package / Case: 0402 (1005 Metric)
XT1 = CRYSTAL_19M2: Oscillator Crystal 25 MHz; Manufacturer: AVX Corp/Kyocera Corp; Manufacturer Part Number 1: CX3225SB30000D0FPLCC; Part Description: 30MHz ±10ppm Crystal 8pF 50 Ohm -40°C ~ 85°C Surface Mount 4-SMD, No Lead (DFN, LCC); Operating Mode: Fundamental; Frequency Tolerance: ±10ppm; Frequency Stability: ±20ppm; Load Capacitance: 8pF; ESR (Equivalent Series Resistance): 50 Ohm; Height: 0.024" (0.60mm); Size / Dimension: 0.126" L x 0.098" W (3.20mm x 2.50mm); Mounting Type: Surface Mount; Package / Case: 4-SMD, No Lead (DFN, LCC); Category: Crystals and Oscillators; Ratings: -; Supplier 1: Digi-Key; Operating Temperature: -40°C ~ 85°C; Packaging: Cut Tape (CT); RoHS: RoHS Compliant; Type: MHz Crystal; Supplier Part Number 1: 1253-1368-1-ND; Frequency: 30MHz; Value: 30MHz